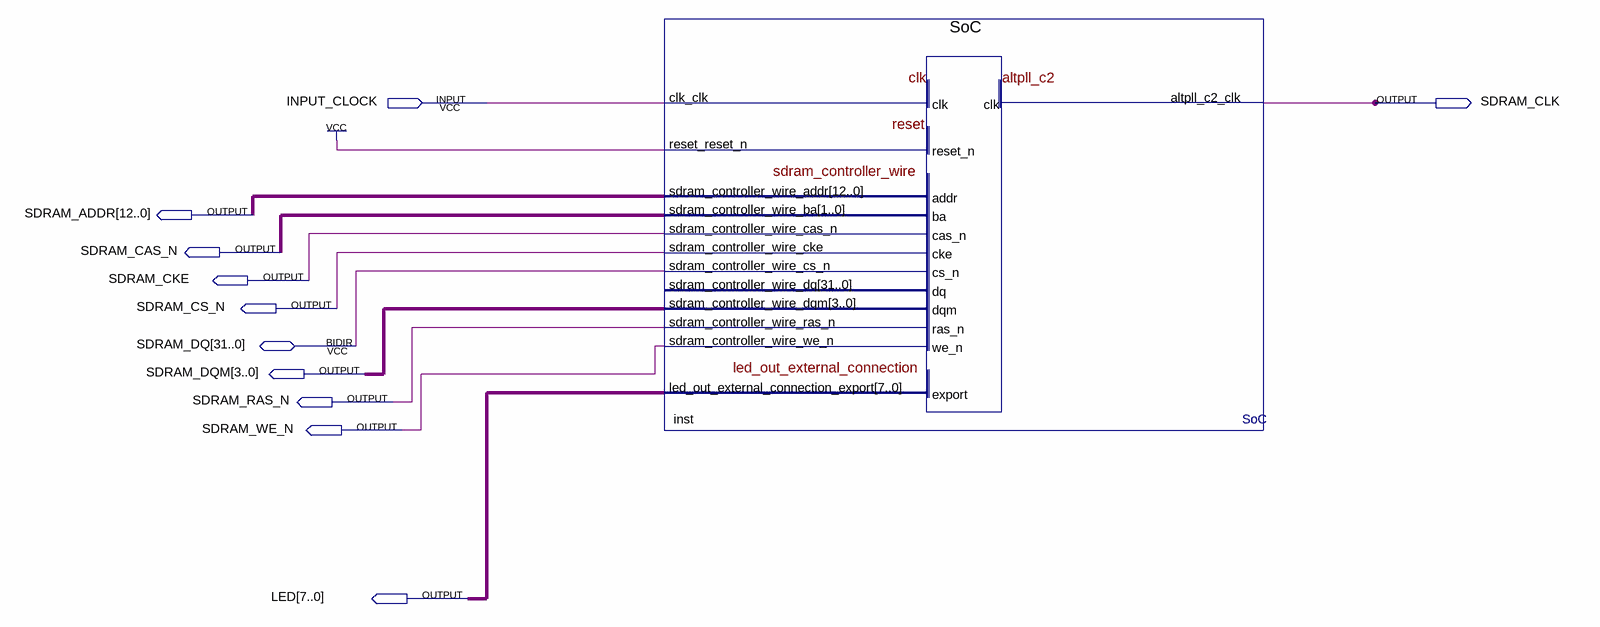
[diagram p0: schematic sheet]
// Quartus schematic JSoC.bdf as structural Verilog: 1 symbols, 11 pins
module JSoC (
  input  INPUT_CLOCK,
  inout  [31:0] SDRAM_DQ,
  output SDRAM_CLK,
  output [12:0] SDRAM_ADDR,
  output SDRAM_CAS_N,
  output SDRAM_CKE,
  output SDRAM_CS_N,
  output [3:0] SDRAM_DQM,
  output SDRAM_RAS_N,
  output SDRAM_WE_N,
  output [7:0] LED
);

  wire inst_sdram_controller_wire_cs_n;
  wire [1:0] inst_sdram_controller_wire_ba;

  SoC inst (
    .clk_clk(INPUT_CLOCK), .reset_reset_n(1'b1), .sdram_controller_wire_addr(SDRAM_ADDR),
    .sdram_controller_wire_ba(inst_sdram_controller_wire_ba), .sdram_controller_wire_cas_n(SDRAM_CKE),
    .sdram_controller_wire_cke(SDRAM_CS_N), .sdram_controller_wire_cs_n(inst_sdram_controller_wire_cs_n),
    .sdram_controller_wire_dqm(SDRAM_DQM), .sdram_controller_wire_ras_n(SDRAM_RAS_N),
    .sdram_controller_wire_we_n(SDRAM_WE_N), .altpll_c2_clk(SDRAM_CLK),
    .led_out_external_connection_export(LED));  // open: sdram_controller_wire_dq
endmodule
